# Altium schematic sheet 40V Output Design.schdoc
size 361 x 165 mm; SheetNumber: 1; SheetTotal: 1
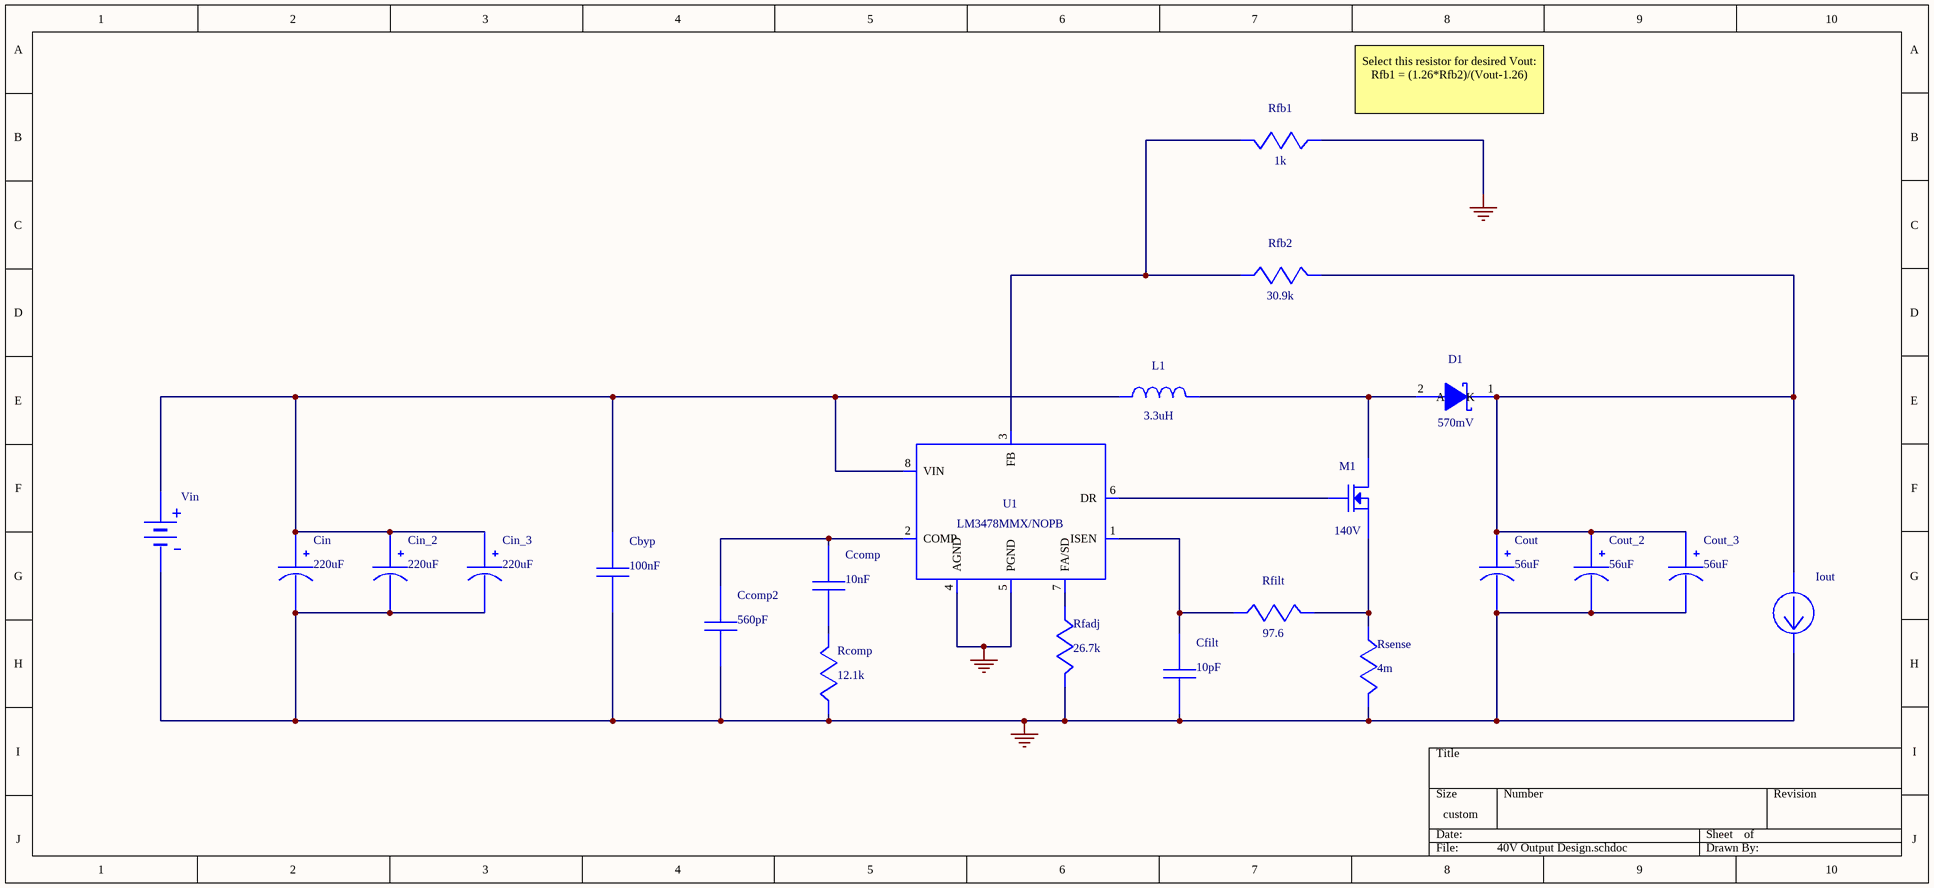
[diagram p0: 40V Output Design.schdoc]

## Parts
Cbyp  value 100nF  (hidden comment: GRM155R70J104KA01D)
Ccomp  value 10nF  (hidden comment: C2012C0G1H103K060AA)
Ccomp2  value 560pF  (hidden comment: GRM1555C1H561JA01J)
Cfilt  value 10pF  (hidden comment: CL21C100JBANNNC)
Cin  value 220uF  (hidden comment: 6SVPE220MW)
Cin_2  value 220uF  (hidden comment: 6SVPE220MW)
Cin_3  value 220uF  (hidden comment: 6SVPE220MW)
Cout  value 56uF  (hidden comment: EEHZA1J560P)
Cout_2  value 56uF  (hidden comment: EEHZA1J560P)
Cout_3  value 56uF  (hidden comment: EEHZA1J560P)
D1  value 570mV  (hidden comment: PMEG6010CEH,115)
Iout  WB_CURRENT_LOAD  (value not drawn)
L1  value 3.3uH  (hidden comment: SRP1235-3R3M)
M1  value 140V  (hidden comment: GENERIC_MOSFET_N)
Rcomp  value 12.1k  (hidden comment: RC0201FR-0712K1L)
Rfadj  value 26.7k  (hidden comment: CRCW040226K7FKED)
Rfb1  value 1k  (hidden comment: RC0603FR-071KL)
Rfb2  value 30.9k  (hidden comment: CRCW040230K9FKED)
Rfilt  value 97.6  (hidden comment: CRCW040297R6FKED)
Rsense  value 4m  (hidden comment: ERJ-M1WSF4M0U)
U1  LM3478MM/NOPB  (value not drawn)
Vin  WB_BATTERY  (value not drawn)

## Nets
0: Cbyp.2 Ccomp2.2 Cfilt.2 Cin.2(-) Cin_2.2(-) Cin_3.2(-) Cout.2(-) Cout_2.2(-) Cout_3.2(-) Iout.2(-) Rcomp.2 Rfadj.1 Rfb1.2 Rsense.1 U1.4(AGND) U1.5(PGND) Vin.2(-)
NetCbyp_1: Cbyp.1 Cin.1(+) Cin_2.1(+) Cin_3.1(+) L1.1 U1.8(VIN) Vin.1(+)
NetCcomp_1: Ccomp.1 Ccomp2.1 U1.2(COMP)
NetCcomp_2: Ccomp.2 Rcomp.1
NetCfilt_1: Cfilt.1 Rfilt.2 U1.1(ISEN)
NetCout_1: Cout.1(+) Cout_2.1(+) Cout_3.1(+) D1.1(K) Iout.1(+) Rfb2.1
NetD1_2: D1.2(A) L1.2 M1.2(Drain)
NetM1_1: M1.1(Gate) U1.6(DR)
NetM1_3: M1.3(Source) Rfilt.1 Rsense.2
NetRfadj_2: Rfadj.2 U1.7(FA/SD)
NetRfb1_1: Rfb1.1 Rfb2.2 U1.3(FB)

## Notes on the sheet
- Select this resistor for desired Vout:
  Rfb1 = (1.26*Rfb2)/(Vout-1.26)

## Library data of the parts
Cbyp = GRM155R70J104KA01D: GRM155R70J104KA0; Manufacturer Name: MuRata; PackageReference: GRM155R70J104KA01D; Manufacturer Part Number: GRM155R70J104KA01D
Ccomp = C2012C0G1H103K060AA: C2012C0G1H103K06; Manufacturer Name: TDK; PackageReference: C2012C0G1H103K060AA; Manufacturer Part Number: C2012C0G1H103K060AA
Ccomp2 = GRM1555C1H561JA01J: GRM1555C1H561JA0; Manufacturer Name: MuRata; PackageReference: GRM1555C1H561JA01J; Manufacturer Part Number: GRM1555C1H561JA01J
Cfilt = CL21C100JBANNNC: Manufacturer Name: Samsung Electro-Mechanics; PackageReference: CL21C100JBANNNC; Manufacturer Part Number: CL21C100JBANNNC
Cin Cin_2 Cin_3 = 6SVPE220MW: Manufacturer Name: Panasonic; PackageReference: 6SVPE220MW; Manufacturer Part Number: 6SVPE220MW
Cout Cout_2 Cout_3 = EEHZA1J560P: Manufacturer Name: Panasonic; PackageReference: EEHZA1J560P; Manufacturer Part Number: EEHZA1J560P
D1 = PMEG6010CEH,115: Manufacturer Name: Nexperia; PackageReference: PMEG6010CEH,115; Manufacturer Part Number: PMEG6010CEH,115
L1 = SRP1235-3R3M: Manufacturer Name: Bourns; PackageReference: SRP1235-3R3M; Manufacturer Part Number: SRP1235-3R3M
M1 = GENERIC_MOSFET_N: IdealFET; Manufacturer Name: NA; PackageReference: IdealFET; Manufacturer Part Number: GENERIC_MOSFET_N
Rcomp = RC0201FR-0712K1L: Manufacturer Name: Yageo; PackageReference: RC0201FR-0712K1L; Manufacturer Part Number: RC0201FR-0712K1L
Rfadj = CRCW040226K7FKED: Manufacturer Name: Vishay-Dale; PackageReference: CRCW040226K7FKED; Manufacturer Part Number: CRCW040226K7FKED
Rfb1 = RC0603FR-071KL: Manufacturer Name: Yageo; PackageReference: RC0603FR-071KL; Manufacturer Part Number: RC0603FR-071KL
Rfb2 = CRCW040230K9FKED: Manufacturer Name: Vishay-Dale; PackageReference: CRCW040230K9FKED; Manufacturer Part Number: CRCW040230K9FKED
Rfilt = CRCW040297R6FKED: Manufacturer Name: Vishay-Dale; PackageReference: CRCW040297R6FKED; Manufacturer Part Number: CRCW040297R6FKED
Rsense = ERJ-M1WSF4M0U: Manufacturer Name: Panasonic; PackageReference: ERJ-M1WSF4M0U; Manufacturer Part Number: ERJ-M1WSF4M0U
U1 = LM3478MM/NOPB: LM3478MMX/NOPB; Manufacturer Name: Texas Instruments; PackageReference: LM3478MMX/NOPB; Manufacturer Part Number: LM3478MM/NOPB; Value: N/A
Iout = WB_CURRENT_LOAD: PackageReference: WB_CURRENT_LOAD; Manufacturer Part Number: WB_CURRENT_LOAD; Manufacturer Name: WB_CURRENT_LOAD; Value: N/A
Vin = WB_BATTERY: PackageReference: WB_BATTERY; Manufacturer Part Number: WB_BATTERY; Manufacturer Name: WB_BATTERY; Value: N/A